# Altium project Racheta_PCB.PrjPcb (part 1 of 2)
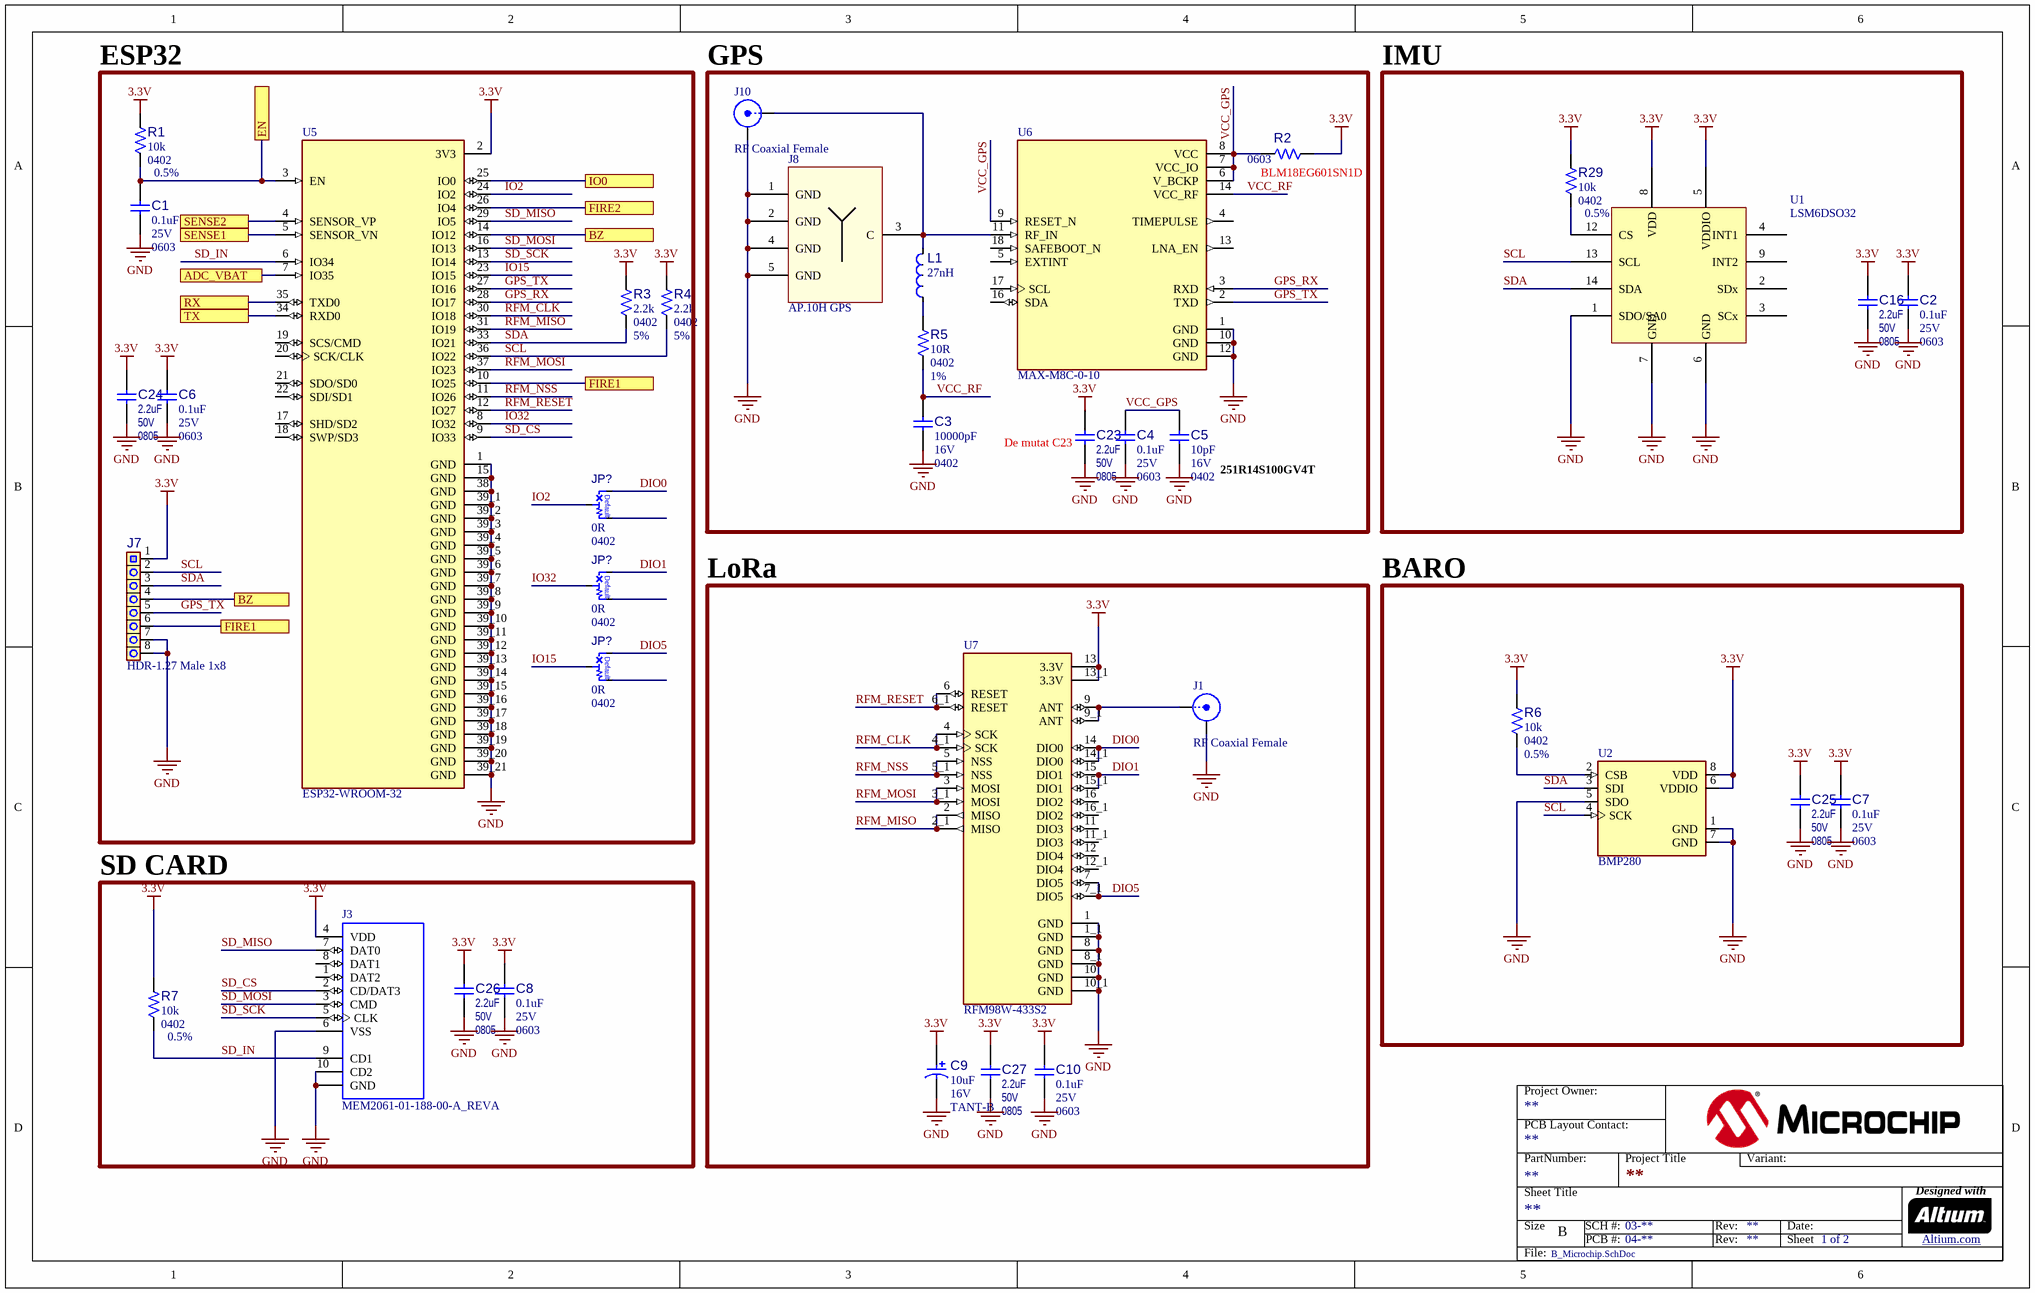
[diagram p0: B_Microchip.SchDoc]
ProjectDrawnBy: **; ProjectEngineer: **; ProjectPartNumber: **; ProjectPCBAssyNumber: **; ProjectPCBNumber: **; ProjectRevisionART: **; ProjectRevisionASSY: **; ProjectRevisionFAB: **; ProjectRevisionSCH: **; ProjectTitle: **
2 sheets, 99 parts. Net scope: flat (ports and power ports of the same name join across sheets).
Board file: 2 Layers.PcbDoc
Sheets:
  B_Microchip.SchDoc
  PowerSupply.SchDoc

## Sheet B_Microchip.SchDoc
size B; CompanyName: Microchip Technology Inc.; Organization: Microchip Technology; Address1: 2355 West Chandler Blvd.; Address2: Chandler, AZ  85224; Address4: USA; SheetNumber: 1; SheetTotal: 2; SheetTitle: **; Time: Time

### Parts
(Parts that share a designator on the sheet are numbered #1, #2 ... from top to bottom, then left to right.)
C1  value 0.1uF  Voltage: 25V  Package: 0603  [CAP_C_0603]  (hidden comment: Capacitor NP)
C2  value 0.1uF  Voltage: 25V  Package: 0603  [CAP_C_0603]  (hidden comment: Capacitor NP)
C3  value 10000pF  Voltage: 16V  Package: 0402  [CAP_C_0402]  (hidden comment: Capacitor NP)
C4  value 0.1uF  Voltage: 25V  Package: 0603  [CAP_C_0603]  (hidden comment: Capacitor NP)
C5  value 10pF  Voltage: 16V  Package: 0402  [CAP_C_0402]  (hidden comment: Capacitor NP)
C6  value 0.1uF  Voltage: 25V  Package: 0603  [CAP_C_0603]  (hidden comment: Capacitor NP)
C7  value 0.1uF  Voltage: 25V  Package: 0603  [CAP_C_0603]  (hidden comment: Capacitor NP)
C8  value 0.1uF  Voltage: 25V  Package: 0603  [CAP_C_0603]  (hidden comment: Capacitor NP)
C9  value 10uF  Voltage: 16V  Package: TANT-B  [CAP_TANT_B]  (hidden comment: Capacitor POL)
C10  value 0.1uF  Voltage: 25V  Package: 0603  [CAP_C_0603]  (hidden comment: Capacitor NP)
C16  value 2.2uF  Voltage: 50V  Package: 0805  [CAP_C_0805]  (hidden comment: Capacitor NP)
C23  value 2.2uF  Voltage: 50V  Package: 0805  [CAP_C_0805]  (hidden comment: Capacitor NP)
C24  value 2.2uF  Voltage: 50V  Package: 0805  [CAP_C_0805]  (hidden comment: Capacitor NP)
C25  value 2.2uF  Voltage: 50V  Package: 0805  [CAP_C_0805]  (hidden comment: Capacitor NP)
C26  value 2.2uF  Voltage: 50V  Package: 0805  [CAP_C_0805]  (hidden comment: Capacitor NP)
C27  value 2.2uF  Voltage: 50V  Package: 0805  [CAP_C_0805]  (hidden comment: Capacitor NP)
J1  value RF Coaxial Female  [CON_SMA_142-0711-821]  (hidden comment: CON_EDGE_SMA)
J3  MEM2061-01-188-00-A_REVA  [GCT_MEM2061-01-188-00-A_REVA]
J7  value HDR-1.27 Male 1x8  [HDR_M_1.27_1x8_V_TH_TMS-108-02-G-S]  (hidden comment: Header 1x8)
J8  AP.10H GPS  [AP.10H_GPS]
J10  value RF Coaxial Female  [CON_SMA_142-0711-821]  (hidden comment: CON_EDGE_SMA)
JP?#1  value 0R  Package: 0402  [RES_C_0402_3P_JUMPER]  (hidden comment: Resistor_Jumper_3P)
JP?#2  value 0R  Package: 0402  [RES_C_0402_3P_JUMPER]  (hidden comment: Resistor_Jumper_3P)
JP?#3  value 0R  Package: 0402  [RES_C_0402_3P_JUMPER]  (hidden comment: Resistor_Jumper_3P)
L1  value 27nH  [IND_C_0402]  (hidden comment: Inductor)
R1  value 10k  Package: 0402  Tolerance: 0.5%  [RES_C_0402]  (hidden comment: Resistor)
R2  value BLM18EG601SN1D  Package: 0603  [RES_C_0603]  (hidden comment: Resistor)
R3  value 2.2k  Package: 0402  Tolerance: 5%  [RES_C_0402]  (hidden comment: Resistor)
R4  value 2.2k  Package: 0402  Tolerance: 5%  [RES_C_0402]  (hidden comment: Resistor)
R5  value 10R  Package: 0402  Tolerance: 1%  [RES_C_0402]  (hidden comment: Resistor)
R6  value 10k  Package: 0402  Tolerance: 0.5%  [RES_C_0402]  (hidden comment: Resistor)
R7  value 10k  Package: 0402  Tolerance: 0.5%  [RES_C_0402]  (hidden comment: Resistor)
R29  value 10k  Package: 0402  Tolerance: 0.5%  [RES_C_0402]  (hidden comment: Resistor)
U1  LSM6DSO32  [PQFN50P250X300X86-14N]
U2  BMP280  [XDCR_BMP280]
U5  ESP32-WROOM-32  [MODULE_ESP32-WROOM-32]
U6  MAX-M8C-0-10  [XCVR_MAX-M8C-0-10]
U7  RFM98W-433S2  [XCVR_RFM98W-433S2]

### Blocks framed on the sheet
ESP32: C1 C6 C24 J7 JP?#1-JP?#3 R1 R3 R4 U5
GPS: C3-C5 C23 J8 J10 L1 R2 R5 U6
IMU: C2 C16 R29 U1
LoRa: C9 C10 C27 J1 U7
BARO: C7 C25 R6 U2
SD CARD: C8 C26 J3 R7

### Ports
ADC_VBAT, BZ, EN, FIRE1, FIRE2, IO0, RX, SENSE1, SENSE2, TX

### Nets
3.3V: C2.2 C6.2 C7.2 C8.2 C9.1 C10.2 C16.2 C23.2 C24.2 C25.2 C26.2 C27.2 J3.4(VDD) J7.1 R1.1 R2.1 R3.2 R4.2 R6.2 R7.1 R29.1 U1.5(VDDIO) U1.8(VDD) U2.6(VDDIO) U2.8(VDD) U5.2(3V3) U7.13(3.3V) U7.13_1(3.3V)
GND: C1.1 C2.1 C3.1 C4.1 C5.1 C6.1 C7.1 C8.1 C9.2 C10.1 C16.1 C23.1 C24.1 C25.1 C26.1 C27.1 J1.2 J3.6(VSS) J3.10(CD2) J3.11(GND) J3.12(GND) J7.7 J7.8 J8.1(GND) J8.2(GND) J8.4(GND) J8.5(GND) J10.2 U1.1(SDO/SA0) U1.6(GND) U1.7(GND) U2.1(GND) U2.5(SDO) U2.7(GND) U5.1(GND) U5.15(GND) U5.38(GND) U5.39_1(GND) U5.39_2(GND) U5.39_3(GND) U5.39_4(GND) U5.39_5(GND) U5.39_6(GND) U5.39_7(GND) U5.39_8(GND) U5.39_9(GND) U5.39_10(GND) U5.39_11(GND) U5.39_12(GND) U5.39_13(GND) U5.39_14(GND) U5.39_15(GND) U5.39_16(GND) U5.39_17(GND) U5.39_18(GND) U5.39_19(GND) U5.39_20(GND) U5.39_21(GND) U6.1(GND) U6.10(GND) U6.12(GND) U7.1(GND) U7.1_1(GND) U7.8(GND) U7.8_1(GND) U7.10(GND) U7.10_1(GND)
ADC_VBAT: U5.7(IO35) ; port ADC_VBAT
BZ: J7.4 U5.14(IO12) ; port BZ
DIO0: JP?#1.1 U7.14(DIO0) U7.14_1(DIO0)
DIO1: JP?#2.1 U7.15(DIO1) U7.15_1(DIO1)
DIO5: JP?#3.1 U7.7(DIO5) U7.7_1(DIO5)
EN: C1.2 R1.2 U5.3(EN) ; port EN
FIRE1: J7.6 U5.10(IO25) ; port FIRE1
FIRE2: U5.26(IO4) ; port FIRE2
GPS_RX: U5.28(IO17) U6.3(RXD)
GPS_TX: J7.5 U5.27(IO16) U6.2(TXD)
IO0: U5.25(IO0) ; port IO0
IO2: JP?#1.2 U5.24(IO2)
IO15: JP?#3.2 U5.23(IO15)
IO32: JP?#2.2 U5.8(IO32)
RFM_CLK: U5.30(IO18) U7.4(SCK) U7.4_1(SCK)
RFM_MISO: U5.31(IO19) U7.2(MISO) U7.2_1(MISO)
RFM_MOSI: U5.37(IO23) U7.3(MOSI) U7.3_1(MOSI)
RFM_NSS: U5.11(IO26) U7.5(NSS) U7.5_1(NSS)
RFM_RESET: U5.12(IO27) U7.6(RESET) U7.6_1(RESET)
RX: U5.35(TXD0) ; port RX
SCL: J7.2 R4.1 U1.13(SCL) U2.4(SCK) U5.36(IO22)
SD_CS: J3.2(CD/DAT3) U5.9(IO33)
SD_IN: J3.9(CD1) R7.2 U5.6(IO34)
SD_MISO: J3.7(DAT0) U5.29(IO5)
SD_MOSI: J3.3(CMD) U5.16(IO13)
SD_SCK: J3.5(CLK) U5.13(IO14)
SDA: J7.3 R3.1 U1.14(SDA) U2.3(SDI) U5.33(IO21)
SENSE1: U5.5(SENSOR_VN) ; port SENSE1
SENSE2: U5.4(SENSOR_VP) ; port SENSE2
TX: U5.34(RXD0) ; port TX
VCC_GPS: C4.2 C5.2 R2.2 U6.6(V_BCKP) U6.7(VCC_IO) U6.8(VCC) U6.9(RESET_N)
VCC_RF: C3.2 R5.1 U6.14(VCC_RF)
NetJ1_1: J1.1 U7.9(ANT) U7.9_1(ANT)
NetJ8_3: J8.3(C) J10.1 L1.2(F) U6.11(RF_IN)
NetL1_1: L1.1(S) R5.2
NetR6_1: R6.1 U2.2(CSB)
NetR29_2: R29.2 U1.12(CS)

Not connected (* = marked no-connect by the designer): J3 1(DAT2) 8(DAT1); JP?#1 3; JP?#2 3; JP?#3 3; U1 2(SDx) 3(SCx) 4(INT1) 9(INT2); U5 17(SHD/SD2) 18(SWP/SD3) 19(SCS/CMD) 20(SCK/CLK) 21(SDO/SD0) 22(SDI/SD1); U6 4(TIMEPULSE) 5(EXTINT) 13(LNA_EN) 16(SDA) 17(SCL) 18(SAFEBOOT_N); U7 11(DIO3) 11_1(DIO3) 12(DIO4) 12_1(DIO4) 16(DIO2) 16_1(DIO2)

### Notes on the sheet
- (near C23) De mutat C23
- (near C5) 251R14S100GV4T
- Project Owner:
- PCB Layout Contact:
- PartNumber:
- Project Title
- Variant:
- Sheet Title
- Size
- B
- SCH #:
- PCB #:
- Rev:
- Date:
- Sheet
- Designed with
- Altium.com <http://go.altium.com/MicrochipLandingPage_Evaluation.html>
- File:
- (in symbol RES2917) Default

### Library data of the parts
C1 C2 C4 C6-C8 C10 = CAP0380: Manufacturer 1: AVX; Manufacturer Part Number 1: 06033D104KAT2A; Description_: CAP CER 0.1uF 25V 10% X5R SMD 0603; Dev Tools Status: Production; Tolerance: 10%; Temperature Coefficient: X5R; Type: Ceramic; Populated: Yes; MCHP-ID: CAP0380; Revision: 1; Symbol: Capacitor NP; Status: MCL Design; ComponentLink1URL: https://chn-vm-apps.microchip.com/mchprepo/parts/Datasheets/smccp.pdf; ComponentLink1Description: SVN Datasheet; ComponentLink2URL: C:\ALTIUM_WORK\00001_MCHP-CDB\Datasheets\smccp.pdf; ComponentLink2Description: Local Datasheet; ComponentLink3URL: C:\ALTIUM_WORK\00001_MCHP-CDB\Library\LibraryRefs\Capacitor NP.SchLib; ComponentLink3Description: Open Symbol; ComponentLink4URL: C:\ALTIUM_WORK\00001_MCHP-CDB\Library\Footprints\CAP_C_0603.PcbLib; ComponentLink4Description: Open Footprint; ComponentLink5Description: Open Footprint 2; ComponentLink6Description: Open Footprint 3; ComponentLink7Description: Open Footprint 4; Operating Temperature: -55C to +85C; Category: Capacitor; Supplier 1: Digi-Key; Supplier Part Number 1: 478-1244-1-ND; Quantity Override: 1
C3 C5 = CAP0278: Manufacturer 1: KEMET; Manufacturer Part Number 1: C0402C103K4RACTU; Description_: CAP CER 10000pF 16V 10% X7R SMD 0402; Dev Tools Status: Production; Tolerance: 10%; Temperature Coefficient: X7R; Type: Ceramic; Populated: YES; MCHP-ID: CAP0278; Revision: 1; Symbol: Capacitor NP; Status: MCL Design; ComponentLink1URL: https://chn-vm-apps.microchip.com/mchprepo/parts/Datasheets/KEM_C1002_X7R_SMD.pdf; ComponentLink1Description: SVN Datasheet; ComponentLink2URL: C:\ALTIUM_WORK\00001_MCHP-CDB\Datasheets\KEM_C1002_X7R_SMD.pdf; ComponentLink2Description: Local Datasheet; ComponentLink3URL: C:\ALTIUM_WORK\00001_MCHP-CDB\Library\LibraryRefs\Capacitor NP.SchLib; ComponentLink3Description: Open Symbol; ComponentLink4URL: C:\ALTIUM_WORK\00001_MCHP-CDB\Library\Footprints\CAP_C_0402.PcbLib; ComponentLink4Description: Open Footprint; ComponentLink5Description: Open Footprint 2; ComponentLink6Description: Open Footprint 3; ComponentLink7Description: Open Footprint 4; Operating Temperature: -55C to +125C; Category: Capacitor; Manufacturer 2: KEMET; Manufacturer Part Number 2: C0402C103K4RAC; Supplier 1: Digi-Key; Supplier Part Number 1: 399-1038-1-ND; Supplier 2: KEMET; Supplier Part Number 2: C0402C103K4RAC; Quantity Override: 1
C9 = CAP0048: Capacitor; Manufacturer 1: AVX; Manufacturer Part Number 1: TAJB106M016Y; Description_: CAP TANT 10uF 16V 20% 2Ohm SMD B; Dev Tools Status: Production; Tolerance: 20%; ESR: 2Ohm; Type: Tantalum; Populated: Yes; MCHP-ID: CAP0048; Revision: 1; Symbol: Capacitor POL; Status: MCL Design; ComponentLink1URL: https://chn-vm-apps.microchip.com/mchprepo/parts/Datasheets/293d.pdf; ComponentLink1Description: SVN Datasheet; ComponentLink2URL: C:\ALTIUM_WORK\00001_MCHP-CDB\Datasheets\293d.pdf; ComponentLink2Description: Local Datasheet; ComponentLink3URL: C:\ALTIUM_WORK\00001_MCHP-CDB\Library\LibraryRefs\Capacitor POL.SchLib; ComponentLink3Description: Open Symbol; ComponentLink4URL: C:\ALTIUM_WORK\00001_MCHP-CDB\Library\Footprints\CAP_TANT_B.PcbLib; ComponentLink4Description: Open Footprint; ComponentLink5Description: Open Footprint 2; ComponentLink6Description: Open Footprint 3; ComponentLink7Description: Open Footprint 4; Operating Temperature: -55C to +85C; Category: Capacitor; Manufacturer 2: Nemco; Manufacturer Part Number 2: PCT10/16BKLF; Manufacturer 3: Nemco; Manufacturer Part Number 3: PCT10/16BMLF; Manufacturer 4: Vishay; Manufacturer Part Number 4: 293D106X0016B2WE3; Manufacturer 5: Vishay; Manufacturer Part Number 5: 293D106X0016B2W; Supplier 1: AVX; Supplier Part Number 1: TAJB106M016Y; Supplier 2: Nemco; Supplier Part Number 2: PCT10/16BKLF; Supplier 3: Nemco; Supplier Part Number 3: PCT10/16BMLF; Supplier 4: Vishay; Supplier Part Number 4: 293D106X0016B2WE3; Supplier 5: Vishay; Supplier Part Number 5: 293D106X0016B2W; Quantity Override: 1
C16 C23-C27 = CAP1017: Capacitor; Manufacturer 1: TDK; Manufacturer Part Number 1: C2012X5R1H225K; Description_: CAP CER 2.2uF 50V 10% X5R SMD 0805; Dev Tools Status: Production; Tolerance: 10%; Temperature Coeffcient: X5R; Type: Ceramic; Owner: Brent Lanphear; Populated: Yes; MCHP-ID: CAP1017; Revision: 2; Symbol: Capacitor NP; Status: MCL Design; ComponentLink1URL: https://chn-vm-apps.microchip.com/mchprepo/parts/Datasheets/general_B11.pdf; ComponentLink1Description: SVN Datasheet; ComponentLink2URL: C:\ALTIUM_WORK\00001_MCHP-CDB\Datasheets\general_B11.pdf; ComponentLink2Description: Local Datasheet; ComponentLink3URL: C:\ALTIUM_WORK\00001_MCHP-CDB\Library\LibraryRefs\Capacitor NP.SchLib; ComponentLink3Description: Open Symbol; ComponentLink4URL: C:\ALTIUM_WORK\00001_MCHP-CDB\Library\Footprints\CAP_C_0805.PcbLib; ComponentLink4Description: Open Footprint; ComponentLink5Description: Open Footprint 2; ComponentLink6Description: Open Footprint 3; ComponentLink7Description: Open Footprint 4; Operating Temperature: -55C to +85C; Category: Capacitor; Supplier 1: Digi-Key; Supplier Part Number 1: 445-5976-1-ND; Quantity Override: 1
J1 J10 = CON1322: Manufacturer 1: Cinch Connectivity Solutions Johnson; Manufacturer Part Number 1: 142-0711-821; Description_: CON RF Coaxial SMA Female 2P EDGE MNT; Dev Tools Status: Production; Owner: Duane Burt; Populated: YES; MCHP-ID: CON1322; Revision: A; Symbol: CON_EDGE_SMA; Status: MCL Design; ComponentLink1URL: https://chn-vm-apps.microchip.com/mchprepo/parts/Datasheets/pi-142-0711-821.pdf; ComponentLink1Description: SVN Datasheet; ComponentLink2URL: C:\ALTIUM_WORK\00001_MCHP-CDB\Datasheets\pi-142-0711-821.pdf; ComponentLink2Description: Local Datasheet; ComponentLink3URL: C:\ALTIUM_WORK\00001_MCHP-CDB\Library\LibraryRefs\CON_EDGE_SMA.SchLib; ComponentLink3Description: Open Symbol; ComponentLink4URL: C:\ALTIUM_WORK\00001_MCHP-CDB\Library\Footprints\CON_SMA_142-0711-821.PcbLib; ComponentLink4Description: Open Footprint; ComponentLink5Description: Open Footprint 2; ComponentLink6Description: Open Footprint 3; ComponentLink7Description: Open Footprint 4; Type: RF; Category: Connector; Supplier 1: Digi-Key; Supplier Part Number 1: J629-ND; Quantity Override: 1
J3 = MEM2061-01-188-00-A_REVA: 10 _8 + 2_ Position Card Connector microSDâ„¢ Surface Mount, Right Angle Gold; MF: Global Connector Technology; SnapEDA_Link: https://www.snapeda.com/parts/MEM2061-01-188-00-A/Global%20Connector%20Technology/view-part/779219/?ref=snap; Package: None; Price: None; Value: *; Availability: Unavailable; MP: MEM2061-01-188-00-A
J7 = CON2104: Manufacturer 1: Samtec Inc.; Manufacturer Part Number 1: TMS-108-02-G-S; Description_: CON HDR-1.27 Male 1x8 Gold 2.54MH TH VERT; Dev Tools Status: Design; Owner: Ciprian Abramov; Current: 5A; Populated: YES; MCHP-ID: CON2104; Revision: 1; Symbol: Header 1x8; Status: MCL Design; ComponentLink1URL: https://chn-vm-apps.microchip.com/mchprepo/parts/Datasheets/tms_th.pdf; ComponentLink1Description: SVN Datasheet; ComponentLink2URL: C:\ALTIUM_WORK\00001_MCHP-CDB\Datasheets\tms_th.pdf; ComponentLink2Description: Local Datasheet; ComponentLink3URL: C:\ALTIUM_WORK\00001_MCHP-CDB\Library\LibraryRefs\Header 1x8.SchLib; ComponentLink3Description: Open Symbol; ComponentLink4URL: C:\ALTIUM_WORK\00001_MCHP-CDB\Library\Footprints\HDR_M_1.27_1x8_V_TH_TMS-108-02-G-S.PcbLib; ComponentLink4Description: Open Footprint; ComponentLink5Description: Open Footprint 2; ComponentLink6Description: Open Footprint 3; ComponentLink7Description: Open Footprint 4; Type: Header 1.27mm; Category: Connector; Supplier 1: Digi-Key; Supplier Part Number 1: SAM15869-ND; Quantity Override: 1; Operating Temperature: -55C to +125C; Assembly Type: TH
JP?#1-JP?#3 = RES2917: Manufacturer 1: Yageo; Manufacturer Part Number 1: AC0402JR-070RL; Description_: RES TKF 0R SMD 3P JUMPER 0402 AEC-Q200; Dev Tools Status: Design; Temperature Coefficient: 100ppm/C; Circuit Type: Isolated; Power: 1/8W; Owner: Florin Paun; Populated: YES; MCHP-ID: RES2917; Revision: 1; Symbol: Resistor_Jumper_3P; Status: MCL Design; ComponentLink1URL: https://chn-vm-apps.microchip.com/mchprepo/parts/Datasheets/PYu-AC_51_RoHS_L_8.pdf; ComponentLink1Description: SVN Datasheet; ComponentLink2URL: C:\ALTIUM_WORK\00001_MCHP-CDB\Datasheets\PYu-AC_51_RoHS_L_8.pdf; ComponentLink2Description: Local Datasheet; ComponentLink3URL: C:\ALTIUM_WORK\00001_MCHP-CDB\Library\LibraryRefs\Resistor_Jumper_3P.SchLib; ComponentLink3Description: Open Symbol; ComponentLink4URL: C:\ALTIUM_WORK\00001_MCHP-CDB\Library\Footprints\RES_C_0402_3P_JUMPER.PcbLib; ComponentLink4Description: Open Footprint; ComponentLink5Description: Open Footprint 2; ComponentLink6Description: Open Footprint 3; ComponentLink7Description: Open Footprint 4; Operating Temperature: -55C to +155C; Category: Resistor; Type: RES SMD; Composition: TKF; Supplier 1: Digi-Key; Supplier Part Number 1: 311-0.0LBTR-ND; Quantity Override: 1
L1 = IND1077: Manufacturer 1: TDK; Manufacturer Part Number 1: MLK1005S27NJ; Description_: INDUCTOR 27nH 200mA 5% SMD 0402; Dev Tools Status: Production; Owner: Tad Ahlvers; DCR: 0.8R; RMS Current: 200mA; Test Frequency: 100MHz; Populated: YES; MCHP-ID: IND1077; Revision: 1; Symbol: Inductor; Status: MCL Design; ComponentLink1URL: https://chn-vm-apps.microchip.com/mchprepo/parts/Datasheets/e521_mlk.pdf; ComponentLink1Description: SVN Datasheet; ComponentLink2URL: C:\ALTIUM_WORK\00001_MCHP-CDB\Datasheets\e521_mlk.pdf; ComponentLink2Description: Local Datasheet; ComponentLink3URL: C:\ALTIUM_WORK\00001_MCHP-CDB\Library\LibraryRefs\Inductor.SchLib; ComponentLink3Description: Open Symbol; ComponentLink4URL: C:\ALTIUM_WORK\00001_MCHP-CDB\Library\Footprints\IND_C_0402.PcbLib; ComponentLink4Description: Open Footprint; ComponentLink5Description: Open Footprint 2; ComponentLink6Description: Open Footprint 3; ComponentLink7Description: Open Footprint 4; Operating Temperature: -55C to +125C; Package: 0402; Type: Inductor; Category: Inductor; Supplier 1: Digi-Key; Supplier Part Number 1: 445-1472-1-ND; Quantity Override: 1
R1 R6 R7 R29 = RES1012: Manufacturer 1: SUSUMU; Manufacturer Part Number 1: RR0510P-103-D; Description_: RES TF 10k 0.5% 1/16W SMD 0402; Dev Tools Status: Production; Voltage: 25V; Temperature Coefficient: 25ppm/C; Power: 1/16W; Owner: Tad Ahlvers; Populated: YES; MCHP-ID: RES1012; Revision: 1; Symbol: Resistor; Status: MCL Design; ComponentLink1URL: https://chn-vm-apps.microchip.com/mchprepo/parts/Datasheets/products_12.pdf; ComponentLink1Description: SVN Datasheet; ComponentLink2URL: C:\ALTIUM_WORK\00001_MCHP-CDB\Datasheets\products_12.pdf; ComponentLink2Description: Local Datasheet; ComponentLink3URL: C:\ALTIUM_WORK\00001_MCHP-CDB\Library\LibraryRefs\Resistor.SchLib; ComponentLink3Description: Open Symbol; ComponentLink4URL: C:\ALTIUM_WORK\00001_MCHP-CDB\Library\Footprints\RES_C_0402.PcbLib; ComponentLink4Description: Open Footprint; ComponentLink5Description: Open Footprint 2; ComponentLink6Description: Open Footprint 3; ComponentLink7Description: Open Footprint 4; Operating Temperature: -55C to +125C; Category: Resistor; Type: RES SMD; Composition: TF; Supplier 1: Digi-Key; Supplier Part Number 1: RR05P10.0KDCT-ND; Quantity Override: 1
R2 = RES1130: Manufacturer 1: Panasonic; Manufacturer Part Number 1: ERJ-3EKF2201V; Tolerance: 1%; Description_: RES TKF 2.2k 1% 1/10W SMD 0603; Dev Tools Status: Production; Voltage: 75V; Temperature Coefficient: 100ppm/C; Power: 1/10W; Owner: Bogdan P (M91398); Populated: Yes; MCHP-ID: RES1130; Revision: 0; Symbol: Resistor; Status: MCL Design; ComponentLink1URL: https://chn-vm-apps.microchip.com/mchprepo/parts/Datasheets/AOA0000CE2.pdf; ComponentLink1Description: SVN Datasheet; ComponentLink2URL: C:\ALTIUM_WORK\00001_MCHP-CDB\Datasheets\AOA0000CE2.pdf; ComponentLink2Description: Local Datasheet; ComponentLink3URL: C:\ALTIUM_WORK\00001_MCHP-CDB\Library\LibraryRefs\Resistor.SchLib; ComponentLink3Description: Open Symbol; ComponentLink4URL: C:\ALTIUM_WORK\00001_MCHP-CDB\Library\Footprints\RES_C_0603.PcbLib; ComponentLink4Description: Open Footprint; ComponentLink5Description: Open Footprint 2; ComponentLink6Description: Open Footprint 3; ComponentLink7Description: Open Footprint 4; Operating Temperature: -55C to +155C; Category: Resistor; Type: RES SMD; Composition: TKF; Supplier 1: Digi-Key; Supplier Part Number 1: P2.20KHCT-ND; Quantity Override: 1
R3 R4 = RES1020: Manufacturer 1: Vishay Dale; Manufacturer Part Number 1: CRCW04022K20JNED; Description_: RES TKF 2.2k 5% 1/16W SMD 0402; Dev Tools Status: Production; Voltage: 50V; Temperature Coefficient: 200ppm/C; Power: 1/16W; Owner: Tad Ahlvers; Populated: YES; MCHP-ID: RES1020; Revision: 1; Symbol: Resistor; Status: MCL Design; ComponentLink1URL: https://chn-vm-apps.microchip.com/mchprepo/parts/Datasheets/dcrcwe3.pdf; ComponentLink1Description: SVN Datasheet; ComponentLink2URL: C:\ALTIUM_WORK\00001_MCHP-CDB\Datasheets\dcrcwe3.pdf; ComponentLink2Description: Local Datasheet; ComponentLink3URL: C:\ALTIUM_WORK\00001_MCHP-CDB\Library\LibraryRefs\Resistor.SchLib; ComponentLink3Description: Open Symbol; ComponentLink4URL: C:\ALTIUM_WORK\00001_MCHP-CDB\Library\Footprints\RES_C_0402.PcbLib; ComponentLink4Description: Open Footprint; ComponentLink5Description: Open Footprint 2; ComponentLink6Description: Open Footprint 3; ComponentLink7Description: Open Footprint 4; Operating Temperature: -55C to +155C; Category: Resistor; Type: RES SMD; Composition: TKF; Supplier 1: Digi-Key; Supplier Part Number 1: 541-2.2KJCT-ND; Quantity Override: 1
R5 = RES1305: Manufacturer 1: ROHM; Manufacturer Part Number 1: MCR01MRTF10R0; Description_: RES TKF 10R 1% 1/16W SMD 0402; Dev Tools Status: Production; Voltage: 50V; Temperature Coefficient: 100ppm/C; Power: 1/16W; Owner: Tad Ahlvers; Populated: YES; MCHP-ID: RES1305; Revision: 1; Symbol: Resistor; Status: MCL Design; ComponentLink1URL: https://chn-vm-apps.microchip.com/mchprepo/parts/Datasheets/mcr_g.pdf; ComponentLink1Description: SVN Datasheet; ComponentLink2URL: C:\ALTIUM_WORK\00001_MCHP-CDB\Datasheets\mcr_g.pdf; ComponentLink2Description: Local Datasheet; ComponentLink3URL: C:\ALTIUM_WORK\00001_MCHP-CDB\Library\LibraryRefs\Resistor.SchLib; ComponentLink3Description: Open Symbol; ComponentLink4URL: C:\ALTIUM_WORK\00001_MCHP-CDB\Library\Footprints\RES_C_0402.PcbLib; ComponentLink4Description: Open Footprint; ComponentLink5Description: Open Footprint 2; ComponentLink6Description: Open Footprint 3; ComponentLink7Description: Open Footprint 4; Operating Temperature: -55C to +155C; Category: Resistor; Type: RES SMD; Composition: TKF; Supplier 1: Digi-Key; Supplier Part Number 1: RHM10.0CDTR-ND; Quantity Override: 1
U2 = BMP280: Pressure Sensor 4.35PSI ~ 15.95PSI _30kPa ~ 110kPa_ Absolute 16b 8-SMD; MF: Bosch; SnapEDA_Link: https://www.snapeda.com/parts/BMP280/Bosch%20Sensortec/view-part/1186631/?ref=snap; Package: SMD-8 Bosch Sensortec; MP: BMP280; Value: *; Digi-Key_Part_Number: 828-1064-1-ND; Digi-Key_Purchase_URL: https://www.digikey.com/product-detail/en/bosch-sensortec/BMP280/828-1064-1-ND/6136315?utm_source=snapeda&utm_medium=aggregator&utm_campaign=symbol
U5 = ESP32-WROOM-32: Bluetooth, WiFi Transceiver Module 2.4GHz ~ 2.5GHz Surface Mount; MF: Espressif Systems; Package: Module Espressif Systems; Digi-Key_Part_Number: 1904-1010-1-ND; Digi-Key_Purchase_URL: https://www.digikey.com/product-detail/en/espressif-systems/ESP32-WROOM-32/1904-1010-1-ND/8544305?utm_source=snapeda&utm_medium=aggregator&utm_campaign=symbol; Value: *; MP: ESP32-WROOM-32; SnapEDA_Link: https://www.snapeda.com/parts/ESP32-WROOM-32/Espressif%20Systems/view-part/2753322/?ref=snap
U6 = MAX-M8C-0-10: u-blox M8 GNSS module, ROM, crystal; MF: U-Blox America; Availability: Unavailable; MP: MAX-M8C-0-10; Price: None; Value: *; SnapEDA_Link: https://www.snapeda.com/parts/MAX-M8C-0-10/U-Blox%20America%20Inc./view-part/4176794/?ref=snap; Package: SMD-18 u-blox
U7 = RFM98W-433S2: 802.15.4, General ISM < 1GHz LoRaâ„¢ Transceiver Module 433MHz Surface Mount; MF: RF Solutions; Value: *; SnapEDA_Link: https://www.snapeda.com/parts/RFM98W-433S2/RF%20Solutions/view-part/583263/?ref=snap; Package: SMD-16 RF Solutions; MP: RFM98W-433S2; Availability: Unavailable; Price: None